# EAGLE design hail-wifi (EAGLE 9.1.2)
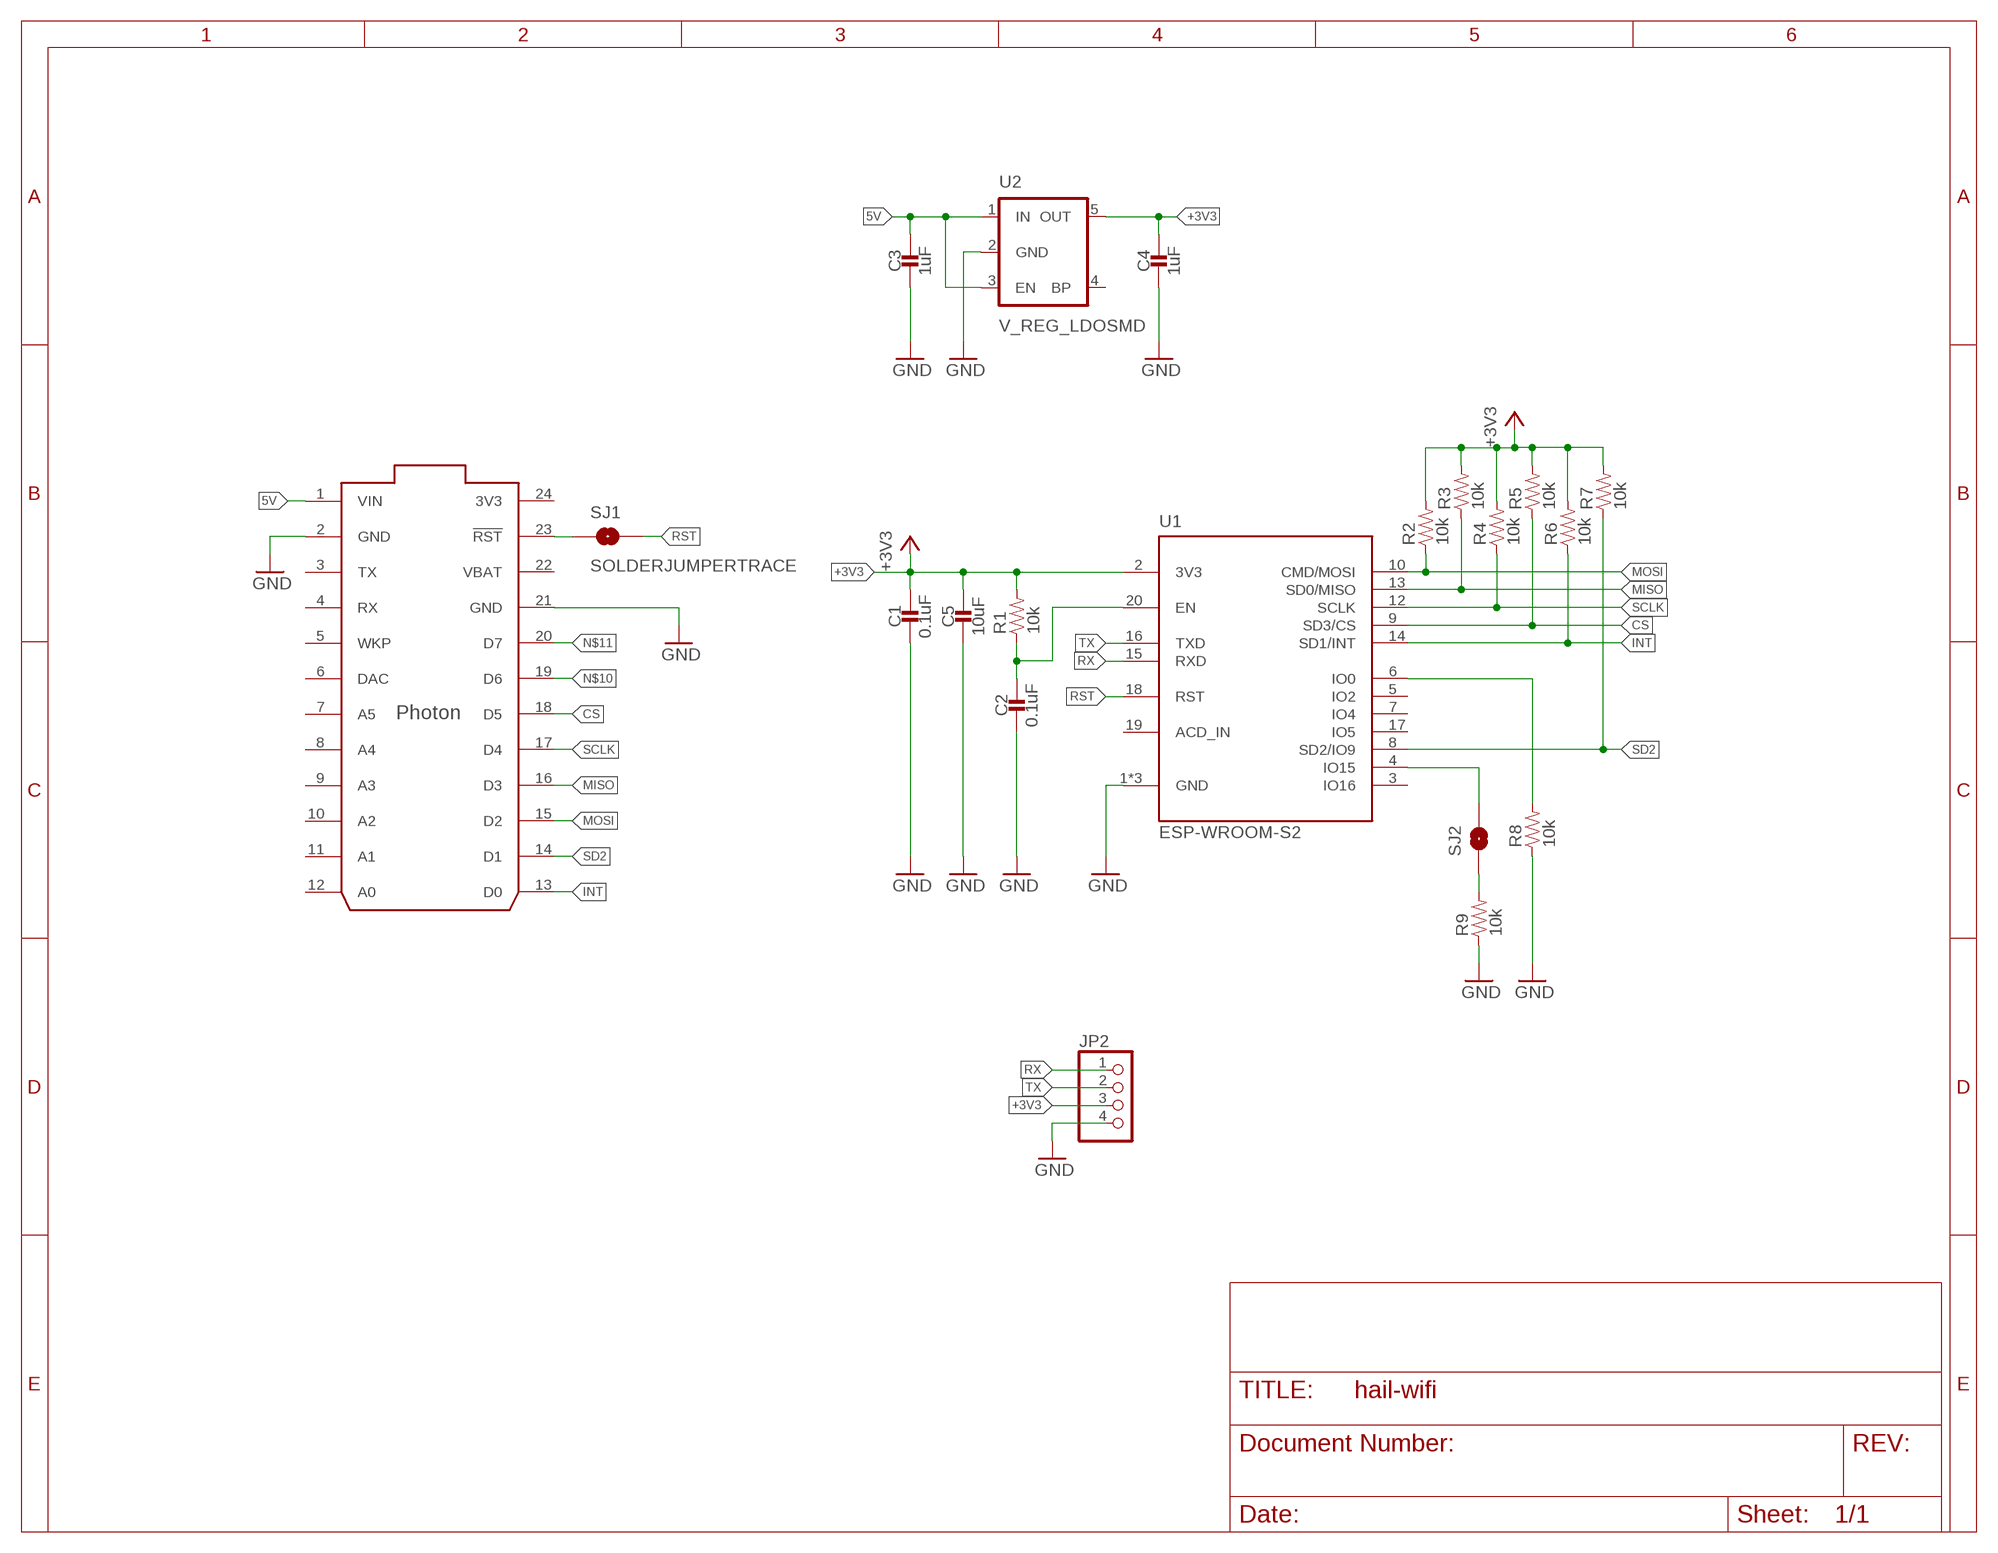
[diagram p0: schematic, sheet 1]

## Parts
C1  0.1uF  CAPACITOR0603_CAP  [0603_CAP]
C2  0.1uF  CAPACITOR0603_CAP  [0603_CAP]
C3  1uF  CAPACITOR0603_CAP  [0603_CAP]
C4  1uF  CAPACITOR0603_CAP  [0603_CAP]
C5  10uF  CAPACITOR0603_CAP  [0603_CAP]
JP2  PINHD-1X4/90  [1X04/90]
R1  10k  RESISTOR0603_RES  [0603-RES]
R2  10k  RESISTOR0603_RES  [0603-RES]
R3  10k  RESISTOR0603_RES  [0603-RES]
R4  10k  RESISTOR0603_RES  [0603-RES]
R5  10k  RESISTOR0603_RES  [0603-RES]
R6  10k  RESISTOR0603_RES  [0603-RES]
R7  10k  RESISTOR0603_RES  [0603-RES]
R8  10k  RESISTOR0603_RES  [0603-RES]
R9  10k  RESISTOR0603_RES  [0603-RES]
SJ1  SOLDERJUMPERTRACE  [SJ_2S-TRACE]
SJ2  SOLDERJUMPERNO  [SJ_2S-NO]
U1  ESP-WROOM-S2  [ESP-WROOM-S2]
U2  V_REG_LDOSMD  [SOT23-5]
U3  PHOTON_WITH_HEADERS  [PHOTON]

## Nets
5V: C3.1 U2.1(IN) U2.3(EN) U3.1(VIN)
+3V3: C1.1 C4.1 C5.1 JP2.3 R1.2 R2.2 R3.2 R4.2 R5.2 R6.2 R7.2 U1.2(3V3) U2.5(OUT)
CS: R5.1 U1.9(SD3/CS) U3.18(D5)
GND: C1.2 C2.2 C3.2 C4.2 C5.2 JP2.4 R8.1 R9.1 U1.1(GND) U1.11(GND) U1.21(GND) U2.2(GND) U3.2(GND) U3.21(GND)
INT: R6.1 U1.14(SD1/INT) U3.13(D0)
MISO: R3.1 U1.13(SD0/MISO) U3.16(D3)
MOSI: R2.1 U1.10(CMD/MOSI) U3.15(D2)
N$2: SJ2.2 U1.4(IO15)
N$3: SJ1.1 U3.23(!RST)
N$4: R9.2 SJ2.1
N$5: R8.2 U1.6(IO0)
N$6: C2.1 R1.1 U1.20(EN)
N$10: U3.19(D6)
N$11: U3.20(D7)
RST: SJ1.2 U1.18(RST)
RX: JP2.1 U1.15(RXD)
SCLK: R4.1 U1.12(SCLK) U3.17(D4)
SD2: R7.1 U1.8(SD2/IO9) U3.14(D1)
TX: JP2.2 U1.16(TXD)
Unconnected: U1.3(IO16) U1.5(IO2) U1.7(IO4) U1.17(IO5) U1.19(ACD_IN) U2.4(BP) U3.3(TX) U3.4(RX) U3.5(WKP) U3.6(DAC) U3.7(A5) U3.8(A4) U3.9(A3) U3.10(A2) U3.11(A1) U3.12(A0)

## Power pins joined to a net without a drawn wire
3V3: U3.24(3V3)
VBAT: U3.22(VBAT)

## Library data of the parts
C1-C5 = passives:CAPACITOR: 0402 Capacitor
JP2 = pinhead:PINHD-1X4: PIN HEADER
R1-R9 = passives:RESISTOR: Resistor Basic schematic elements and footprints for 0603, 1206, and PTH resistors.
SJ1 SJ2 = SparkFun-Passives:SOLDERJUMPER: Solder Jumper Standard SMD solder jumper. Used to automate production. Two varients : Normally Open and Normally Closed are the same, but have different paste layers. NC will have a large amount of paste and should jumper during reflow.
U1 = esp-wroom:ESP-WROOM-S2: WiFi Modules (802.11) ESP-WROOM-S2, SMD Module, ESP8266EX, 16Mbits SPI Flash, SPI Mode; MOUSER: 356-ESP-WROOM-S2
U2 = SparkFun-PowerIC:V_REG_LDO: Voltage Regulator LDO Standard 150mA LDO voltage regulator in SOT-23 layout. Micrel part MIC5205. BP (by-pass) pin is used to lower output noise with 470pF cap.
U3 = Particle-Devices:PHOTON: Particle Photon Wi-Fi through-hole development board footprint Product datasheet: here <https://docs.particle.io/datasheets/photon-(wifi)/photon-datasheet/> Design files: here <https://github.com/particle-iot/photon> Github : Particle devices library <https://github.com/particle-iot/hardware-libraries/tree/master/Eagle>

## Board
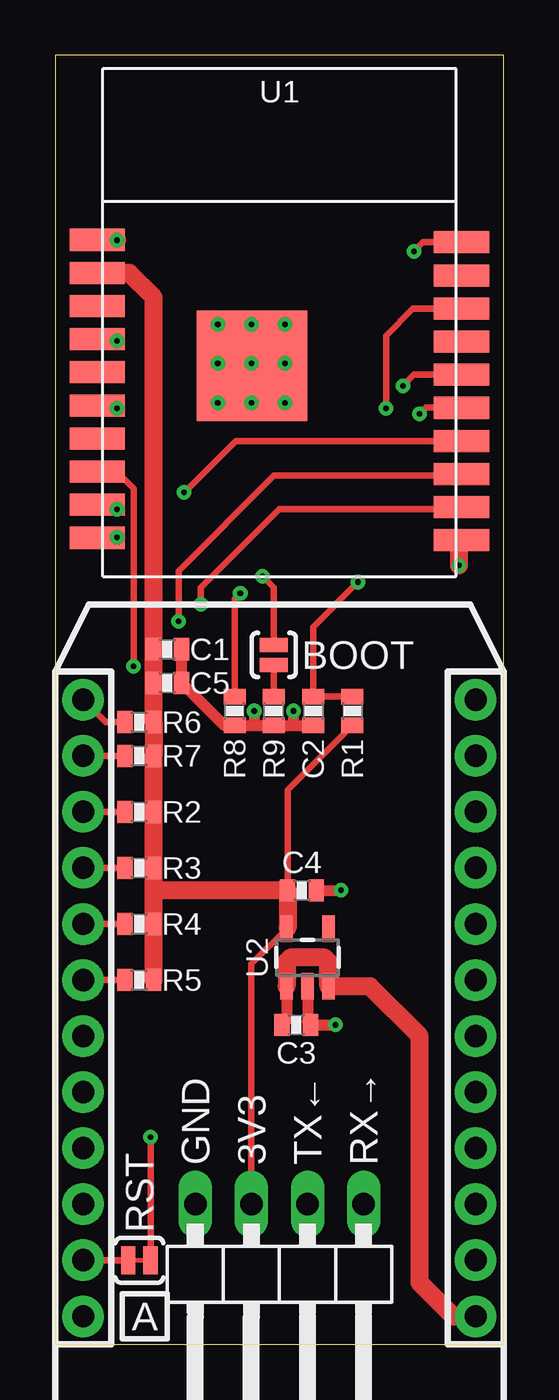
[diagram p1: board, top side]
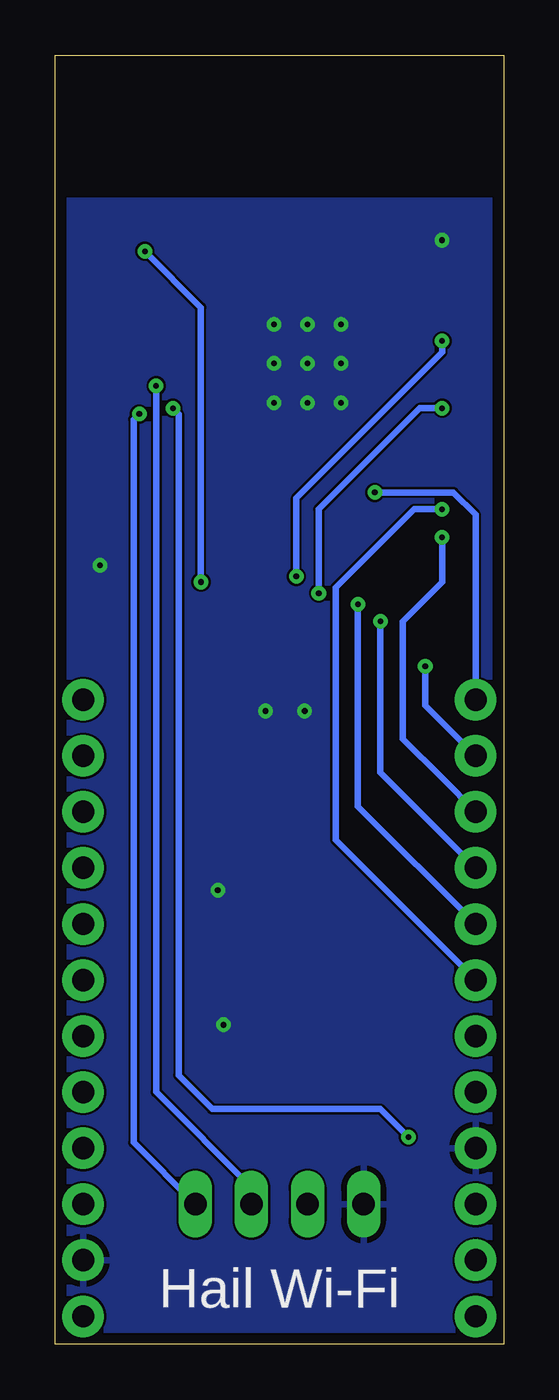
[diagram p2: board, bottom side, seen from below]

Size 20.32 x 58.42 mm. Coordinates in mm from the lower left corner, seen from the top.
Outline: 0,0 20.32,0 20.32,58.42 0,58.42 0,0
Copper layers (1*16): Top 0.0178mm / dielectric 59mil / Bottom 0.0178mm
Design rules "quickturn_co_kr_1oz": minimum track width 4mil, minimum drill 0.200659375mm, track to track 4mil, track to pad 4mil, pad to pad 4mil, via to via 4mil, smd to smd 4mil, copper to edge 20mil, drill to drill 16mil, minimum pad ring 8mil, minimum via ring 8mil, stop-mask expansion 3mil, vias tented up to drill 50mil, thermal gap 10mil

### Footprints (pad centres in the part's own frame; a part is rotated, then mirrored left to right if it is on the bottom)
0603_CAP = smd 0.7 x 1: 1 -0.65,0; 2 0.65,0
1X04/90 = drill 1.016 long: 1 -3.81,-3.81; 2 -1.27,-3.81; 3 1.27,-3.81; 4 3.81,-3.81
0603-RES = smd 0.7 x 1: 1 -0.65,0; 2 0.65,0
SJ_2S-TRACE = smd 0.635 x 1.27: 1 -0.508,0; 2 0.508,0
SJ_2S-NO = smd 0.635 x 1.27: 1 -0.45,0; 2 0.45,0
ESP-WROOM-S2 = smd 2.5 x 1: 1 -0.25,15.25; 2 -0.25,13.75; 3 -0.25,12.25; 4 -0.25,10.75; 5 -0.25,9.25; 6 -0.25,7.75; 7 -0.25,6.25; 8 -0.25,4.75; 9 -0.25,3.25; 10 -0.25,1.75; 11 16.25,1.64; 12 16.25,3.14; 13 16.25,4.64; 14 16.25,6.14; 15 16.25,7.64; 16 16.25,9.14; 17 16.25,10.64; 18 16.25,12.14; 19 16.25,13.64; 20 16.25,15.14 | smd 5 x 5: 21 6.75,9.55
SOT23-5 = smd 0.55 x 1.2: 1 -0.95,-1.3; 2 0,-1.3; 3 0.95,-1.3; 4 0.95,1.3; 5 -0.95,1.3
PHOTON = drill 1.016 pad 1.88: 1 1.27,33.02; 2 1.27,30.48; 3 1.27,27.94; 4 1.27,25.4; 5 1.27,22.86; 6 1.27,20.32; 7 1.27,17.78; 8 1.27,15.24; 9 1.27,12.7; 10 1.27,10.16; 11 1.27,7.62; 12 1.27,5.08; 13 19.05,5.08; 14 19.05,7.62; 15 19.05,10.16; 16 19.05,12.7; 17 19.05,15.24; 18 19.05,17.78; 19 19.05,20.32; 20 19.05,22.86; 21 19.05,25.4; 22 19.05,27.94; 23 19.05,30.48; 24 19.05,33.02

### Placement (x,y rotation side)
C1  5.08,31.5 0 top
C2  11.68,28.7 270 top
C3  10.92,14.48 0 top
C4  11.18,20.57 0 top
C5  5.08,29.97 0 top
JP2  10.16,2.54 180 top
R1  13.46,28.7 270 top
R2  3.81,24.13 0 top
R3  3.81,21.59 0 top
R4  3.81,19.05 0 top
R5  3.81,16.51 0 top
R6  3.81,28.19 0 top
R7  3.81,26.67 0 top
R8  8.13,28.7 90 top
R9  9.91,28.7 90 top
SJ1  3.81,3.81 0 top
SJ2  9.91,31.24 90 top
U1  2.16,34.8 0 top
U2  11.43,17.53 0 top
U3  20.32,34.29 180 top

### Tracks (layer width: path | path; a pad name or v marks a point on that pad's centre or on a via)
5V
  Top 0.508: U2.1 10.48,14.69 C3.1
  Top 0.813: U3.1 18.03,1.27 16.51,2.79 16.51,13.97 14.25,16.23 U2.3 12.38,17.34 12.19,17.53 10.67,17.53 10.48,17.34 U2.1
+3V3
  Top 0.305: C4.1 10.53,25.12 R1.2 | JP2.3 8.89,17.24 10.53,18.87
  Top 0.508: 10.53,18.87 U2.5 | C1.1 4.46,31.47 4.46,29.97 C5.1
  Top 0.813: R5.2 R4.2 4.46,20.57 | 4.46,20.57 R3.2 R2.2 R7.2 R6.2 4.46,29.97 4.46,47.45 3.36,48.55 U1.2 | 10.53,18.87 C4.1 4.46,20.57
CS  (via drill 0.25)
  Top 0.305: R5.1 U3.18
  Top 0.508: v2.79,37.85 2.59,38.05 U1.9
  Bottom 0.305: U3.18 7.62,22.86 7.62,34.29 4.06,37.85 v2.79,37.85
GND  (via drill 0.25)
  Top 0.508: U2.2 11.43,14.62 C3.2 v12.7,14.48 | 9.14,28.05 R8.1 7.65,28.05 C5.2 C1.2 | 9.14,28.05 R9.1 10.92,28.05 | 10.92,28.05 C2.2 | v9.02,28.7 9.02,28.18 9.14,28.05 | v10.79,28.7 10.79,28.18 10.92,28.05 | C4.2 v12.95,20.57 | v8.89,44.45 v8.89,44.46 8.89,44.37 U1.21
  Top 0.813: U1.11 18.29,36.32 v18.29,35.31 | U1.1 v2.78,50.05 v2.79,50.04
  other vias: 7.37,46.23 8.89,46.23 10.41,46.23 10.41,44.45 10.41,42.67 7.37,44.45 8.89,42.67 7.37,42.67
  pour Bottom: 0,51.82 20.32,51.82 20.32,0 0,0
INT  (via drill 0.25)
  Top 0.305: R6.1 2.29,28.19 U3.13 | v5.84,38.61 8.17,40.94 U1.14
  Bottom 0.305: U3.13 1.27,37.59 2.29,38.61 v5.84,38.61
MISO  (via drill 0.25)
  Top 0.305: R3.1 U3.16 | U1.13 18.39,39.37 11.94,39.37 9.91,39.37 5.59,35.05 v5.59,32.77
  Bottom 0.305: U3.16 5.59,25.91 v5.59,32.77
MOSI  (via drill 0.25)
  Top 0.305: R2.1 U3.15
  Top 0.508: v2.79,36.58 2.77,36.55 U1.10
  Bottom 0.305: U3.15 2.79,25.65 4.57,27.43 4.57,32.77 2.79,34.54 v2.79,36.58
N$2  (via drill 0.25)
  Top 0.305: SJ2.2 9.91,34.29 v9.4,34.8 | v2.79,45.47 1.91,45.47 U1.4
  Bottom 0.305: v9.4,34.8 9.4,38.35 2.79,44.96 v2.79,45.47
N$3
  Top 0.305: U3.23 SJ1.1
N$4
  Top 0.305: R9.2 SJ2.1
N$5  (via drill 0.25)
  Top 0.305: U1.6 1.91,42.42 v2.79,42.42 | R8.2 8.13,33.78 v8.38,34.04
  Bottom 0.305: v8.38,34.04 8.38,37.85 3.81,42.42 v2.79,42.42
N$6  (via drill 0.25)
  Top 0.305: R1.1 C2.1 11.68,32.51 v13.72,34.54 | v16.26,49.53 16.28,49.5 16.28,49.56 16.66,49.94 U1.20
  Bottom 0.305: v13.72,34.54 13.72,46.99 v16.26,49.53
RST  (via drill 0.25)
  Top 0.305: v14.99,42.42 14.99,45.72 16.2,46.94 U1.18 | v4.32,9.4 SJ1.2
  Bottom 0.305: v4.32,9.4 5.59,10.67 13.21,10.67 14.73,12.19 14.73,42.16 v14.99,42.42
RX  (via drill 0.25)
  Top 0.305: v16.51,42.16 16.78,42.44 U1.15
  Bottom 0.305: JP2.1 16.76,9.14 16.76,41.91 v16.51,42.16
SCLK  (via drill 0.25)
  Top 0.305: R4.1 U3.17 | U1.12 18.38,37.85 10.16,37.85 6.6,34.29 v6.6,33.53
  Bottom 0.305: v6.6,33.53 6.6,24.38 U3.17
SD2  (via drill 0.25)
  Top 0.305: U3.14 R7.1 | v3.56,30.73 3.56,38.79 2.8,39.55 U1.8
  Bottom 0.305: U3.14 3.56,28.96 v3.56,30.73
TX  (via drill 0.25)
  Top 0.305: v15.75,43.43 16.25,43.94 U1.16
  Bottom 0.305: v15.75,43.43 15.75,11.43 11.43,7.11 JP2.2

### Text on the board
tPlace: BOOT | GND | 3V3 | TX← | RX→ | RST | A
bPlace: Hail Wi-Fi